# EasyEDA schematic SCH_Electric Target_2022-06-11.json
TITLE: Electronic Target Turn; REV: 1.4; Date: 2021-08-17; Sheet: 1/1; Drawn By: smdial; Company: Scott Dial
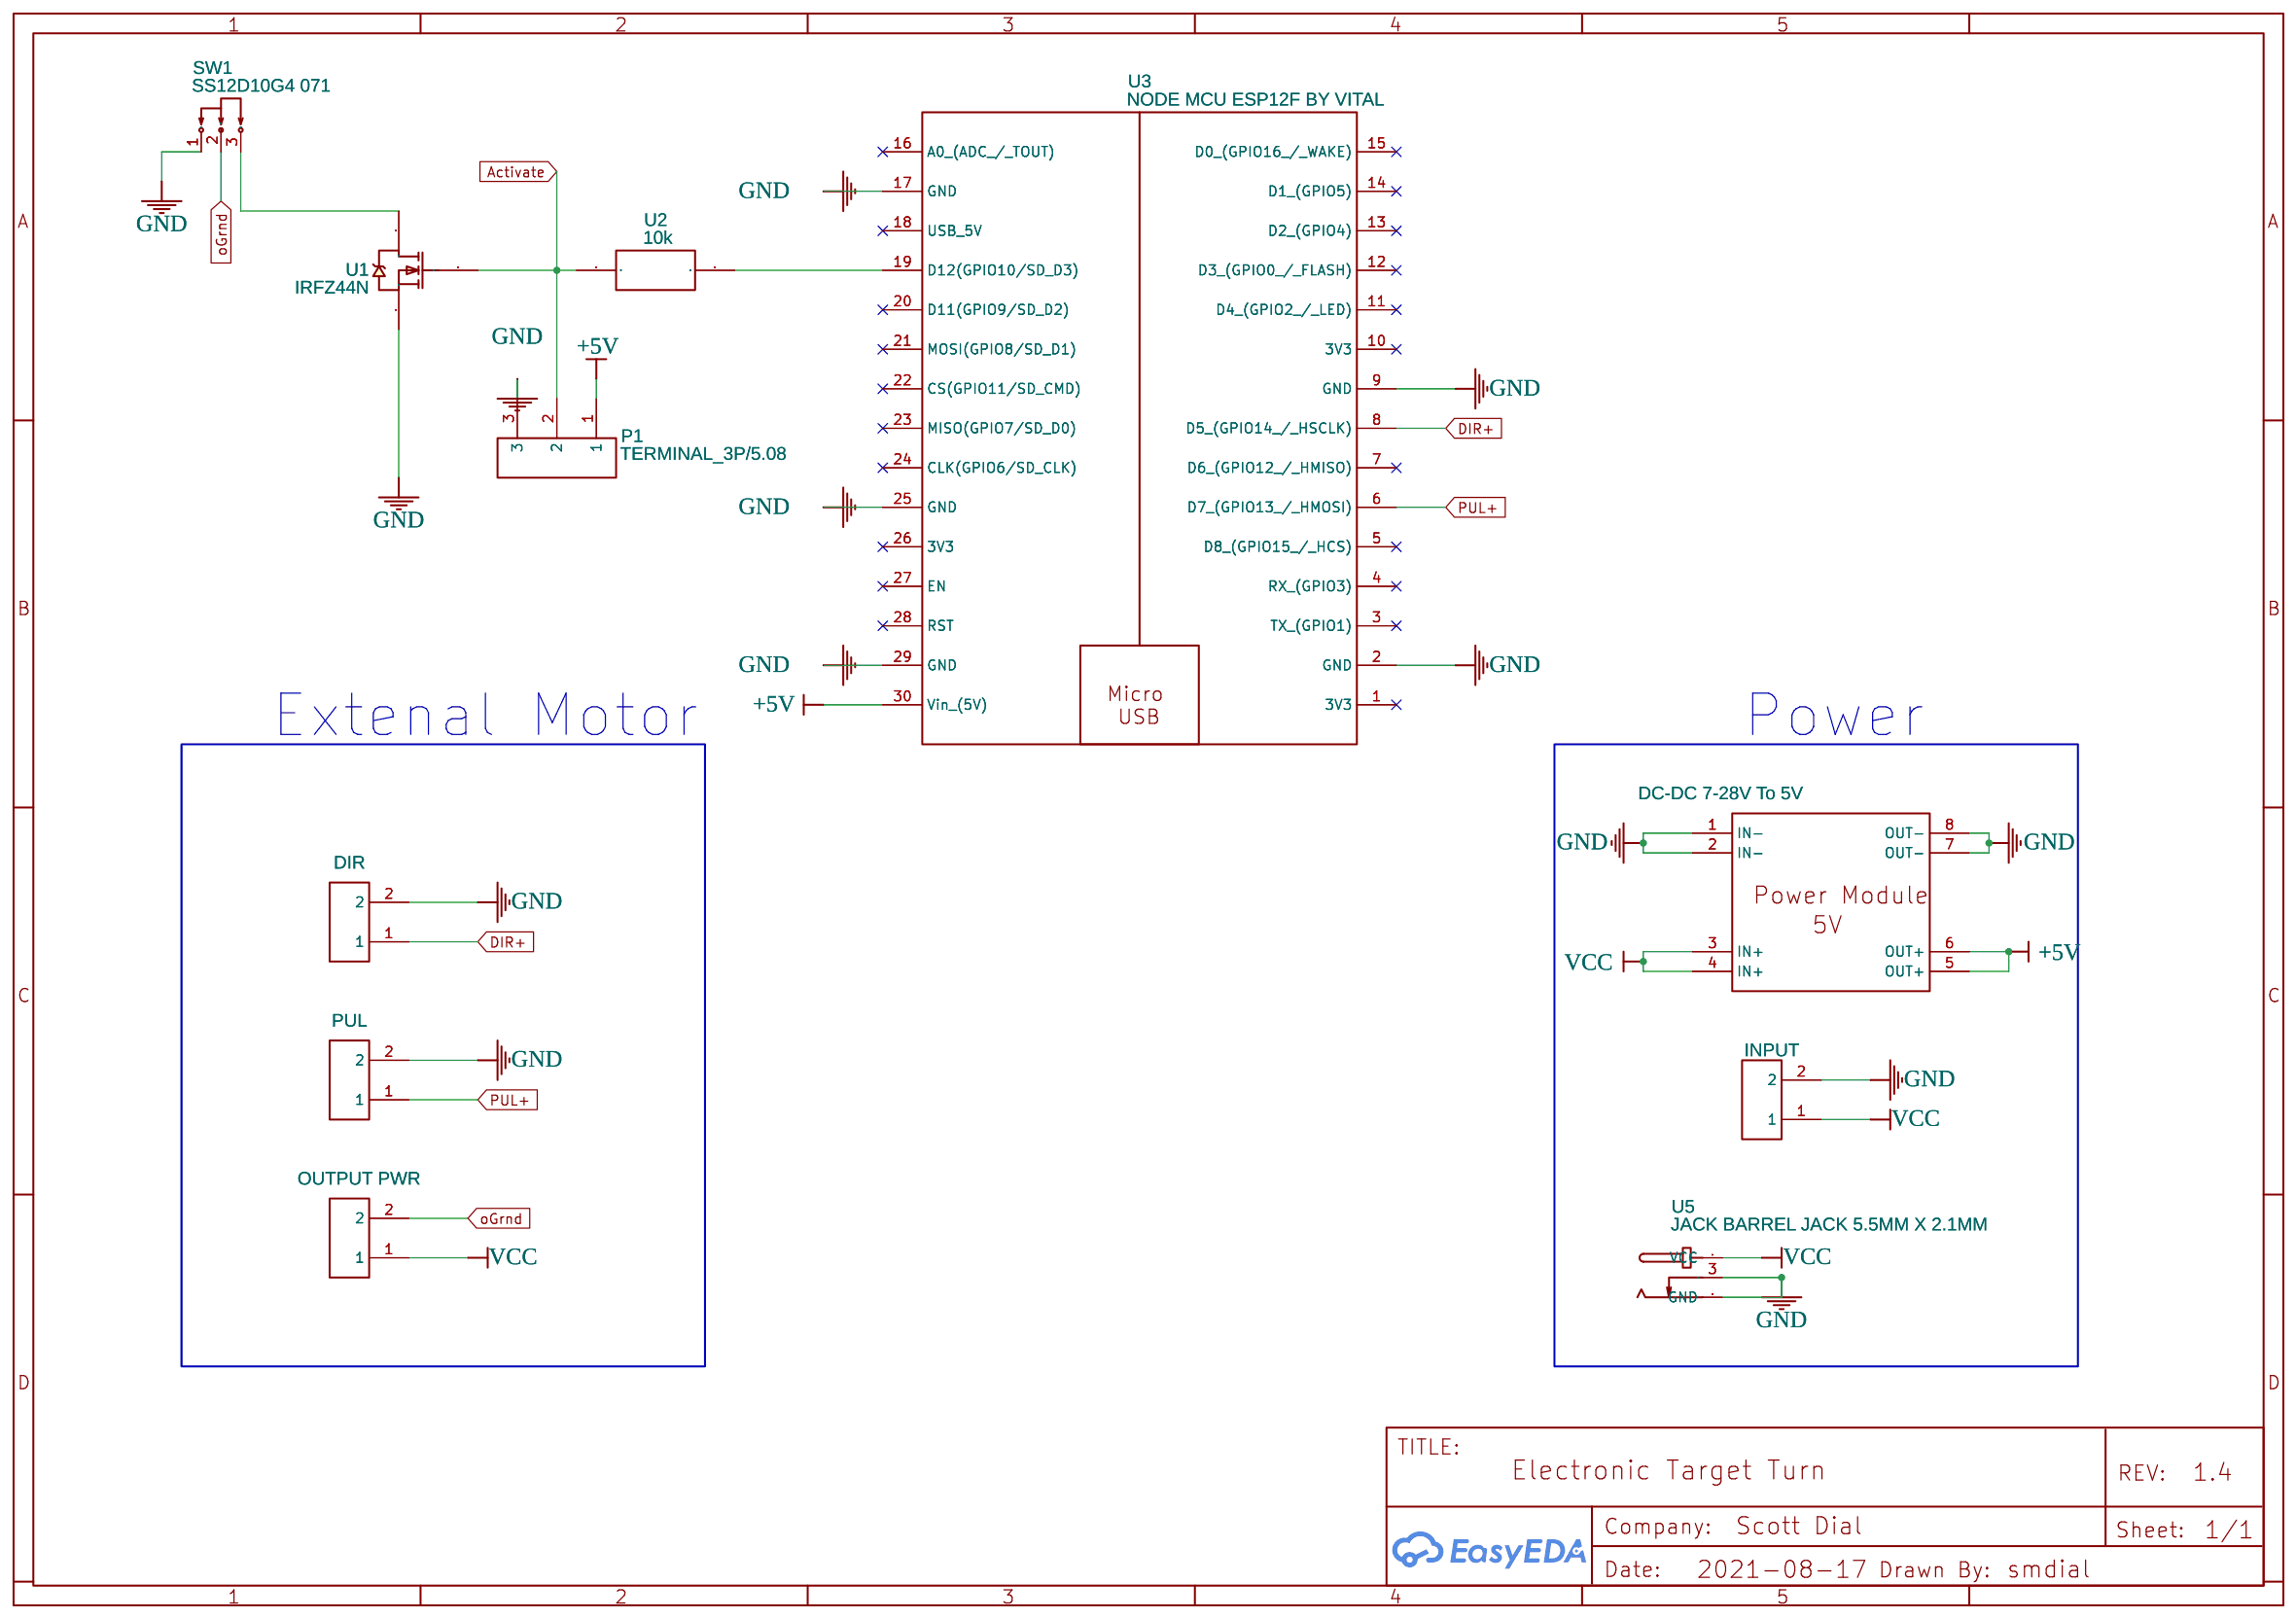
[diagram p0: schematic sheet]

## Parts
P1  TERMINAL_3P/5.08  [5.08-3P_SCREW_TERMINAL]
P2  DIR  [5.08-2P_SCREW_TERMINAL]
P5  PUL  [5.08-2P_SCREW_TERMINAL]
P6  INPUT  [5.08-2P_SCREW_TERMINAL]
P7  OUTPUT PWR  [5.08-2P_SCREW_TERMINAL]
SW1  SS12D10G4 071  [SW-TH_SHOU-HAN_SS12D10G4]
U1  IRFZ44N  [IRFZ44N]
U2  10k  [RESISTOR]
U3  NODE MCU ESP12F BY VITAL  [NODE MCU V3 BY VITAL]
U4  DC-DC 7-28V To 5V  [DM02]
U5  JACK BARREL JACK 5.5MM X 2.1MM  [BARREL JACK DC]

## Library data of the parts
P1 = TERMINAL_3P/5.08: Manufacturer Part: Screw terminal 3p; Contributor: reino.forward
P2 P5-P7 = SCREW TERMINAL 2P: Manufacturer Part: Screw terminal 2p; Contributor: georges_circuits
SW1 = SS12D10G4 071: Supplier: LCSC; Supplier Part: C2887259; Manufacturer: SHOU HAN(首韩); Contributor: LCSC; JLCPCB Part Class: Extended Part
U1 = IRFZ44N: Manufacturer: International Rectifier; link: https://www.vishay.com/docs/91291/91291.pdf; Contributor: mehmetbey
U2 = RESISTOR: Contributor: 12348
U3 = NODE MCU ESP12F BY VITAL: Contributor: vitalgolov_2141
U4 = DC-DC 7-28V To 5V Step Down Power Supply Module: link: DM02 POWER MODULE; Contributor: wichienkob
U5 = JACK BARREL JACK 5.5MM X 2.1MM: Contributor: Sean Simpson

## Nets
+5V: P1.1 U3.30(Vin (5V)) U4.5(OUT+) U4.6(OUT+)
GND: P1.3 P2.2 P5.2 P6.2 SW1.1 U1.3(S) U3.2(GND) U3.9(GND) U3.17(GND) U3.25(GND) U3.29(GND) U4.1(IN-) U4.2(IN-) U4.7(OUT-) U4.8(OUT-) U5.2(GND) U5.3
VCC: P6.1 P7.1 U4.3(IN+) U4.4(IN+) U5.1(VCC)
Activate: P1.2 U1.1(G) U2.2
DIR+: P2.1 U3.8(D5 (GPIO14 / HSCLK))
oGrnd: P7.2 SW1.2
PUL+: P5.1 U3.6(D7 (GPIO13 / HMOSI))
Net-(SW1-3): SW1.3 U1.2(D)
Net-(U2-1): U2.1 U3.19(D12(GPIO10/SD_D3))

Not connected (* = marked no-connect by the designer): U3 1(3V3)* 3(TX (GPIO1))* 4(RX (GPIO3))* 5(D8 (GPIO15 / HCS))* 7(D6 (GPIO12 / HMISO))* 10(3V3)* 11(D4 (GPIO2 / LED))* 12(D3 (GPIO0 / FLASH))* 13(D2 (GPIO4))* 14(D1 (GPIO5))* 15(D0 (GPIO16 / WAKE))* 16(A0 (ADC / TOUT))* 18(USB 5V)* 20(D11(GPIO9/SD_D2))* 21(MOSI(GPIO8/SD_D1))* 22(CS(GPIO11/SD_CMD))* 23(MISO(GPIO7/SD_D0))* 24(CLK(GPIO6/SD_CLK))* 26(3V3)* 27(EN)* 28(RST)*

## Notes on the sheet
- Extenal Motor
- Power
